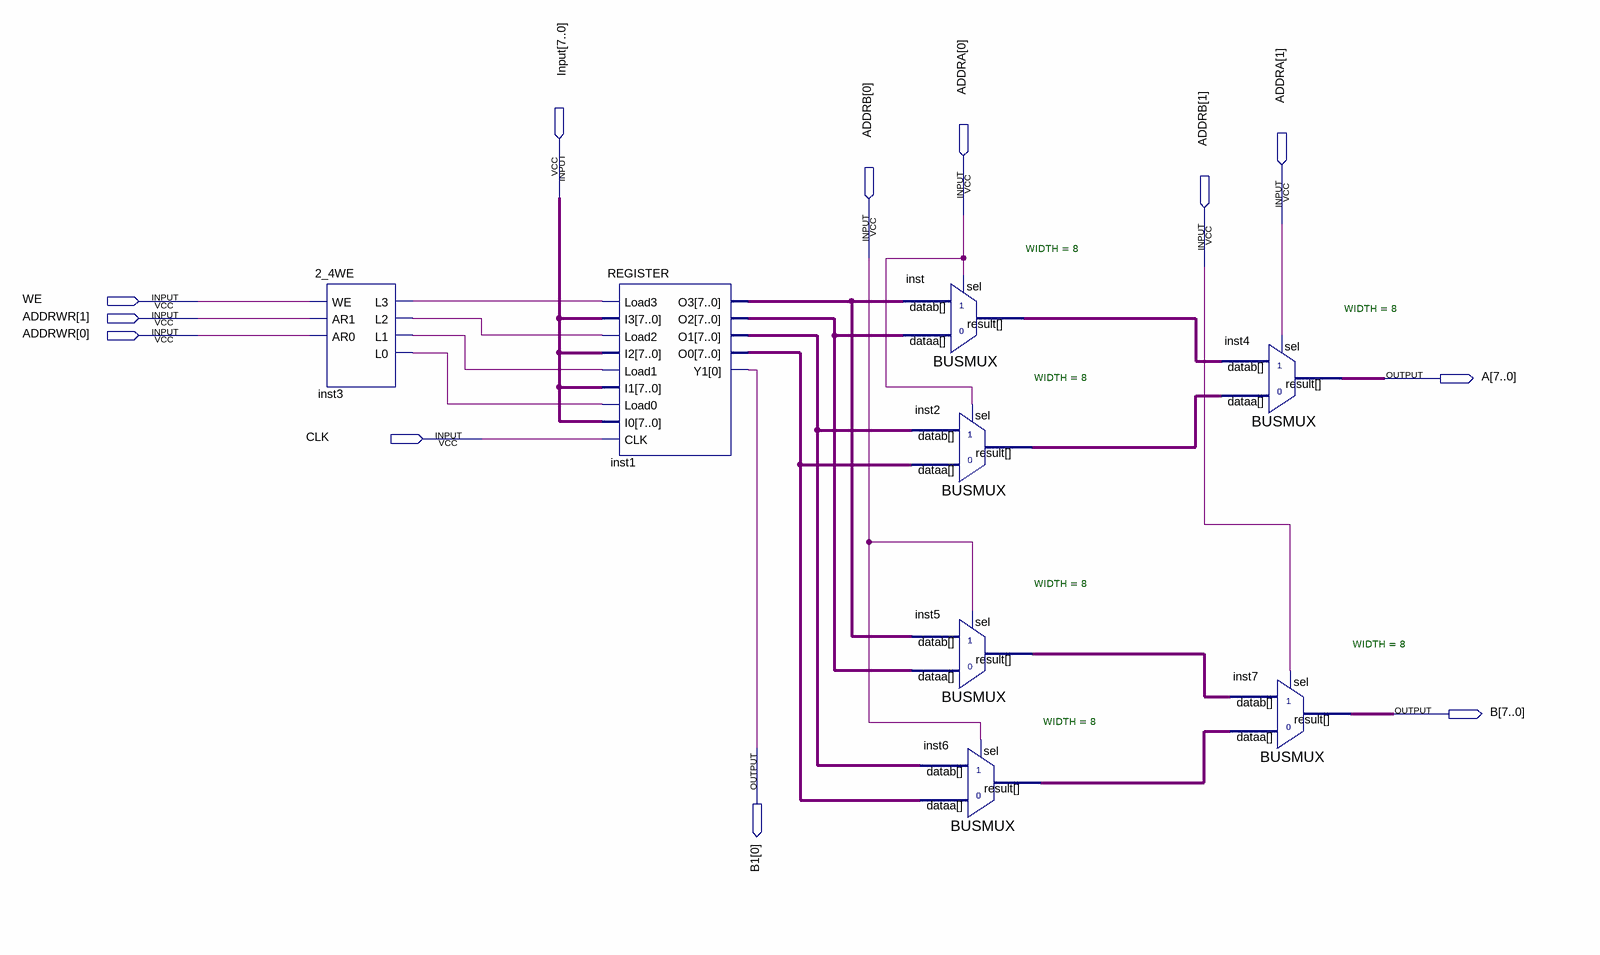
[diagram p0: schematic sheet]
// Quartus schematic Register_File.bdf as structural Verilog: 8 symbols, 12 pins
module Register_File (
  input  [7:0] Input,
  input  [1:0] ADDRA,
  input  [1:0] ADDRB,
  input  WE,
  input  [1:0] ADDRWR,
  input  CLK,
  output [7:0] A,
  output [7:0] B,
  output [0:0] B1
);

  wire inst3_l0, inst3_l1, inst3_l2, inst3_l3;
  wire [7:0] inst1_o0, inst1_o1, inst1_o2, inst1_o3, inst2_result, inst5_result, inst6_result, inst_result;

  \2_4WE  inst3 (.WE(WE), .AR1(ADDRWR[1]), .AR0(ADDRWR[0]), .L3(inst3_l3), .L2(inst3_l2), .L1(inst3_l1), .L0(inst3_l0));
  REGISTER inst1 (
    .Load3(inst3_l3), .I3(Input), .Load2(inst3_l2), .I2(Input), .Load1(inst3_l1), .I1(Input),
    .Load0(inst3_l0), .I0(Input), .CLK(CLK), .O3(inst1_o3), .O2(inst1_o2), .O1(inst1_o1), .O0(inst1_o0),
    .Y1(B1[0]));
  BUSMUX #(.WIDTH(8)) inst (.dataa(inst1_o2), .datab(inst1_o3), .sel(ADDRA[0]), .result(inst_result));
  BUSMUX #(.WIDTH(8)) inst2 (.dataa(inst1_o0), .datab(inst1_o1), .sel(ADDRA[0]), .result(inst2_result));
  BUSMUX #(.WIDTH(8)) inst5 (.dataa(inst1_o2), .datab(inst1_o3), .sel(ADDRB[0]), .result(inst5_result));
  BUSMUX #(.WIDTH(8)) inst6 (.dataa(inst1_o0), .datab(inst1_o1), .sel(ADDRB[0]), .result(inst6_result));
  BUSMUX #(.WIDTH(8)) inst4 (.dataa(inst2_result), .datab(inst_result), .sel(ADDRA[1]), .result(A));
  BUSMUX #(.WIDTH(8)) inst7 (.dataa(inst6_result), .datab(inst5_result), .sel(ADDRB[1]), .result(B));
endmodule
